# EasyEDA Pro project Charger Splitter.eprj, schematic Schematic1
Board Name: Board1; Create Date: 2025-09-04; Page Name: P1; Project Name: Charger Splitter; Schematic Name: Schematic1; Update Date: 2025-09-11; Company: EasyEDA.com; Page Size: A4; Version: V1.0
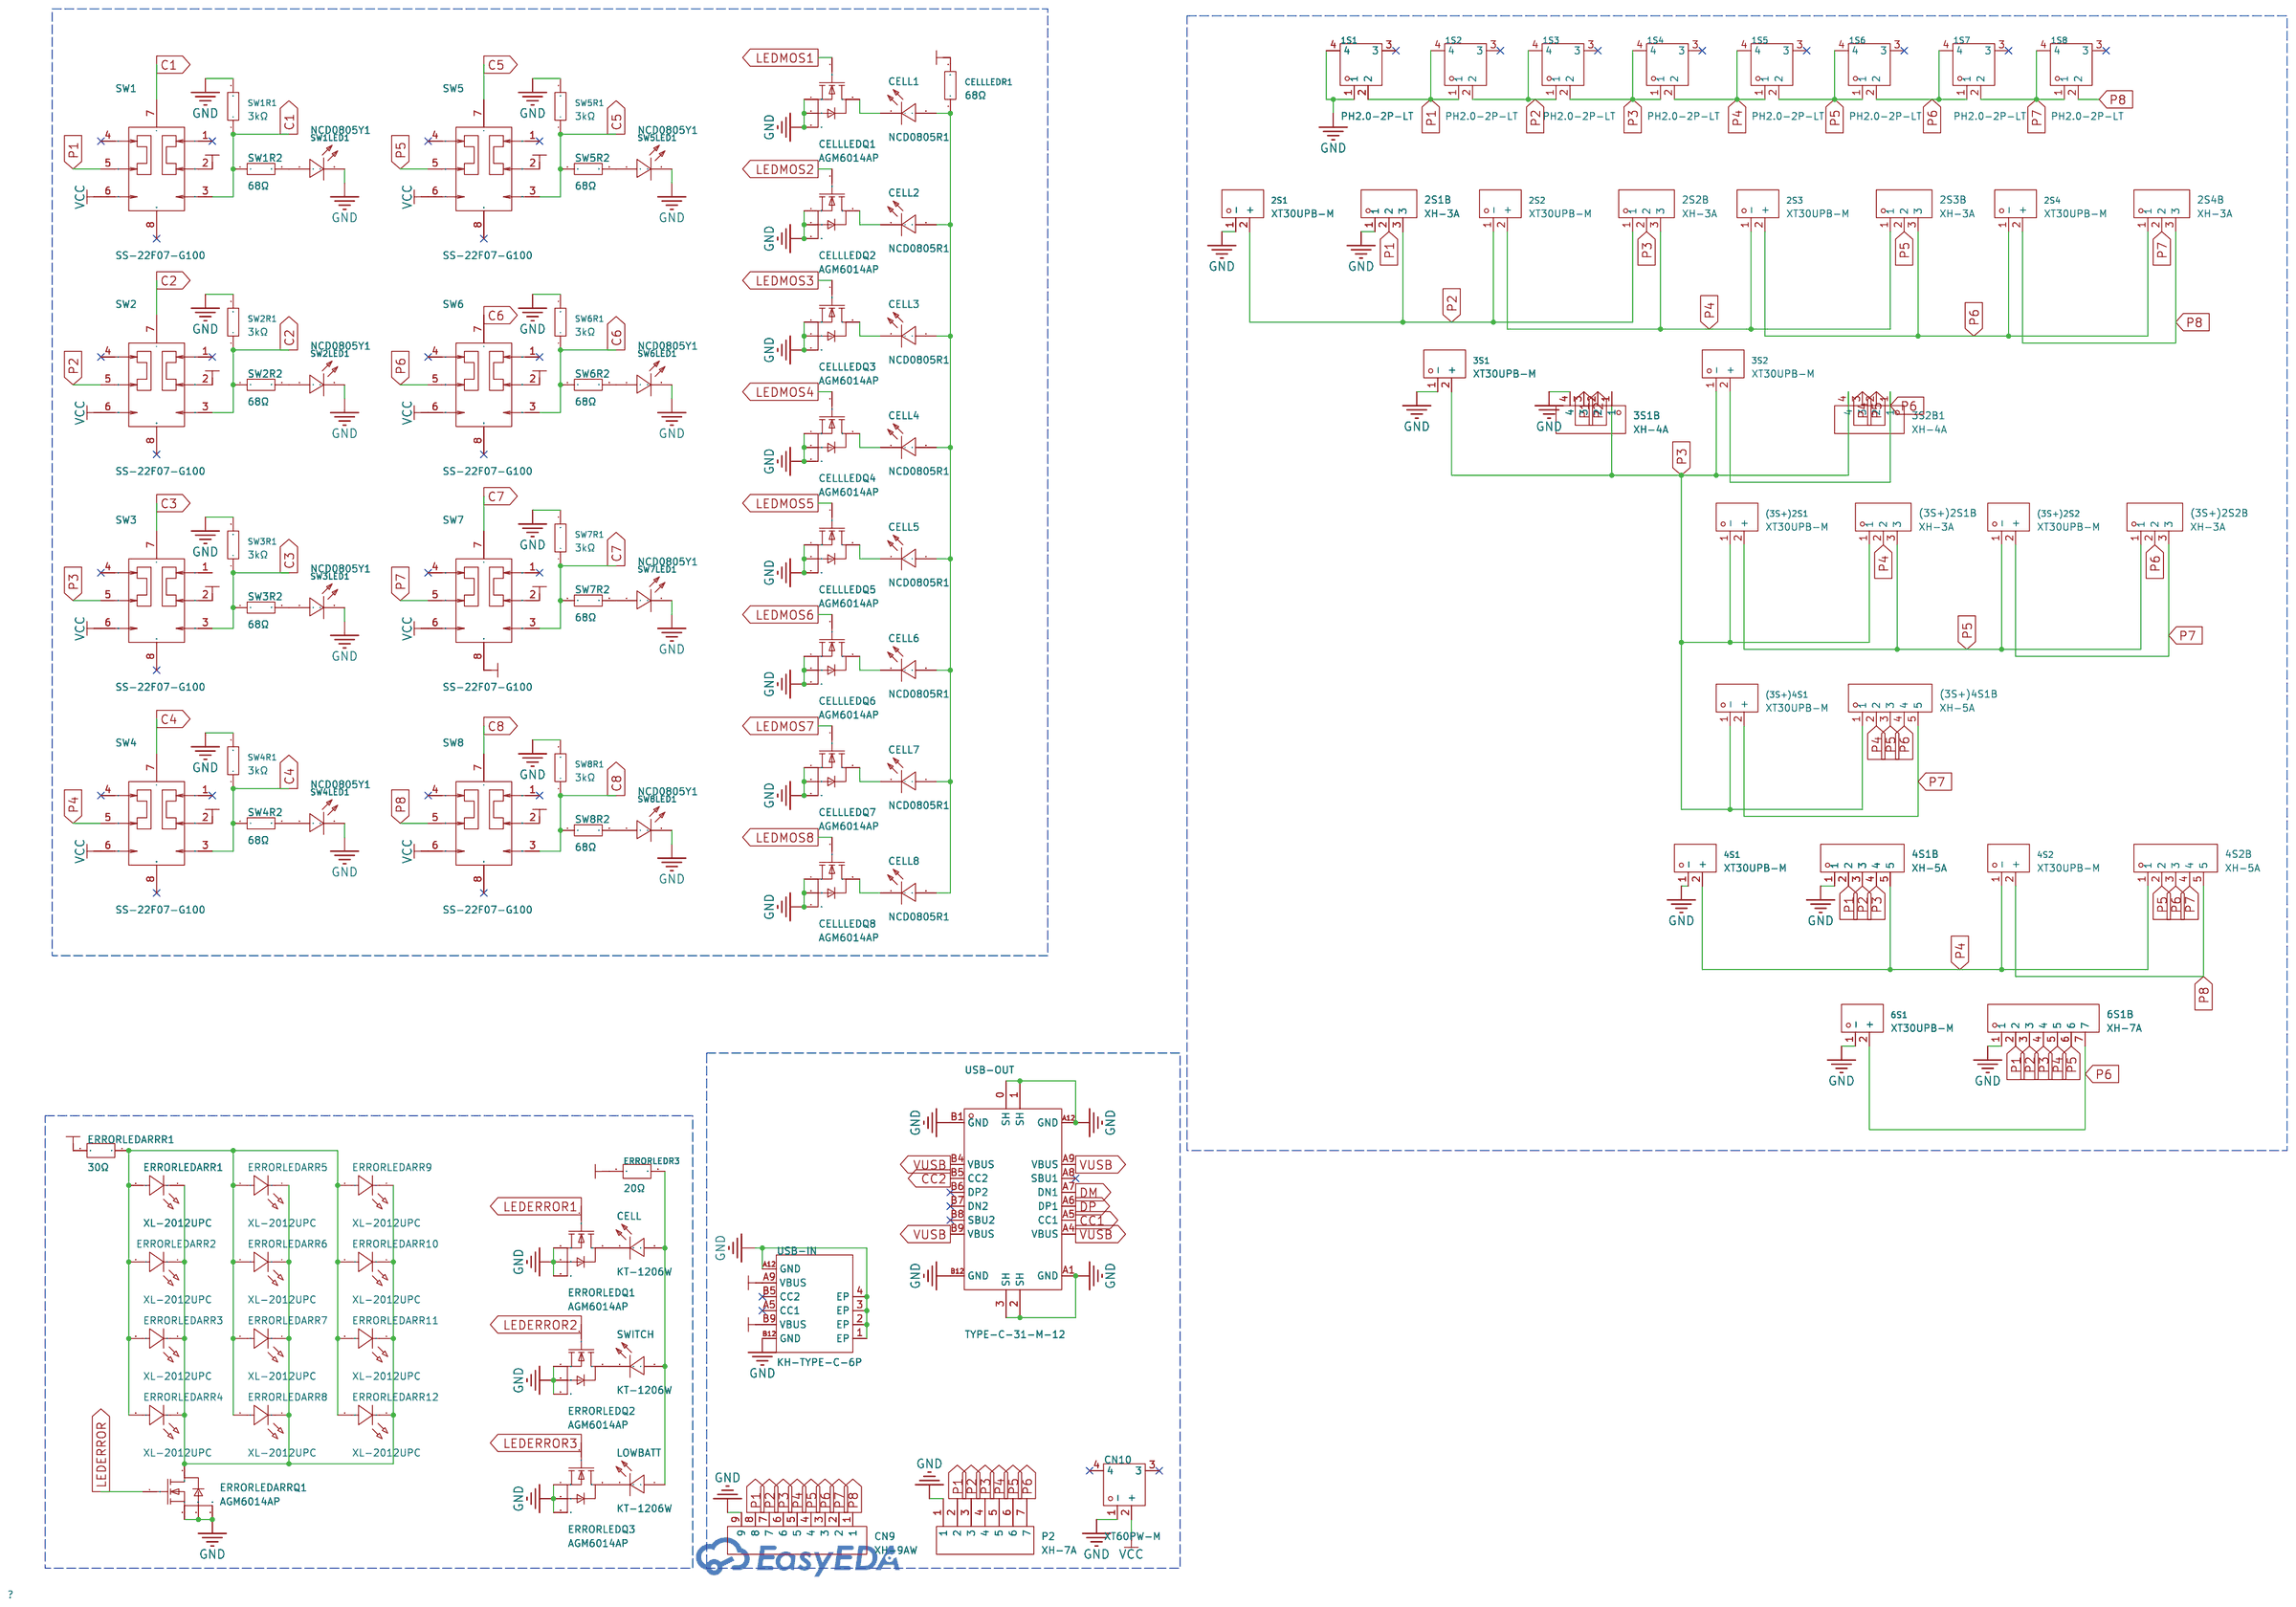
[diagram p0: schematic sheet]

## Parts
1S1  PH2.0-2P-LT  [CONN-SMD_PH2.0-1X2PW]
1S2  PH2.0-2P-LT  [CONN-SMD_PH2.0-1X2PW]
1S3  PH2.0-2P-LT  [CONN-SMD_PH2.0-1X2PW]
1S4  PH2.0-2P-LT  [CONN-SMD_PH2.0-1X2PW]
1S5  PH2.0-2P-LT  [CONN-SMD_PH2.0-1X2PW]
1S6  PH2.0-2P-LT  [CONN-SMD_PH2.0-1X2PW]
1S7  PH2.0-2P-LT  [CONN-SMD_PH2.0-1X2PW]
1S8  PH2.0-2P-LT  [CONN-SMD_PH2.0-1X2PW]
2S1  XT30UPB-M  [CONN-TH_XT30UPB-M]
2S1B  XH-3A  [CONN-TH_XH-3A]
2S2  XT30UPB-M  [CONN-TH_XT30UPB-M]
2S2B  XH-3A  [CONN-TH_XH-3A]
2S3  XT30UPB-M  [CONN-TH_XT30UPB-M]
2S3B  XH-3A  [CONN-TH_XH-3A]
2S4  XT30UPB-M  [CONN-TH_XT30UPB-M]
2S4B  XH-3A  [CONN-TH_XH-3A]
3S1  XT30UPB-M  [CONN-TH_XT30UPB-M]
3S1B  XH-4A  [CONN-TH_XH2.50-4P]
3S2  XT30UPB-M  [CONN-TH_XT30UPB-M]
3S2B1  XH-4A  [CONN-TH_XH2.50-4P]
4S1  XT30UPB-M  [CONN-TH_XT30UPB-M]
4S1B  XH-5A  [CONN-TH_5P-P2.50_XH-5A]
4S2  XT30UPB-M  [CONN-TH_XT30UPB-M]
4S2B  XH-5A  [CONN-TH_5P-P2.50_XH-5A]
6S1  XT30UPB-M  [CONN-TH_XT30UPB-M]
6S1B  XH-7A  [CONN-TH_7P-P2.50_HCTL_XH-7A]
(3S+)2S1  XT30UPB-M  [CONN-TH_XT30UPB-M]
(3S+)2S1B  XH-3A  [CONN-TH_XH-3A]
(3S+)2S2  XT30UPB-M  [CONN-TH_XT30UPB-M]
(3S+)2S2B  XH-3A  [CONN-TH_XH-3A]
(3S+)4S1  XT30UPB-M  [CONN-TH_XT30UPB-M]
(3S+)4S1B  XH-5A  [CONN-TH_5P-P2.50_XH-5A]
CELL  KT-1206W  [LED1206-R-RD_WHITE]
CELL1  NCD0805R1  [LED0805-R-RD]
CELL2  NCD0805R1  [LED0805-R-RD]
CELL3  NCD0805R1  [LED0805-R-RD]
CELL4  NCD0805R1  [LED0805-R-RD]
CELL5  NCD0805R1  [LED0805-R-RD]
CELL6  NCD0805R1  [LED0805-R-RD]
CELL7  NCD0805R1  [LED0805-R-RD]
CELL8  NCD0805R1  [LED0805-R-RD]
CELLLEDQ1  AGM6014AP  [PDFN-8_L3.1-W3.0-P0.65-LS3.3-BL]
CELLLEDQ2  AGM6014AP  [PDFN-8_L3.1-W3.0-P0.65-LS3.3-BL]
CELLLEDQ3  AGM6014AP  [PDFN-8_L3.1-W3.0-P0.65-LS3.3-BL]
CELLLEDQ4  AGM6014AP  [PDFN-8_L3.1-W3.0-P0.65-LS3.3-BL]
CELLLEDQ5  AGM6014AP  [PDFN-8_L3.1-W3.0-P0.65-LS3.3-BL]
CELLLEDQ6  AGM6014AP  [PDFN-8_L3.1-W3.0-P0.65-LS3.3-BL]
CELLLEDQ7  AGM6014AP  [PDFN-8_L3.1-W3.0-P0.65-LS3.3-BL]
CELLLEDQ8  AGM6014AP  [PDFN-8_L3.1-W3.0-P0.65-LS3.3-BL]
CELLLEDR1  68Ω  [R2512]
CN9  XH-9AW  [CONN-TH_9P-P2.50_XH-9AW]
CN10  XT60PW-M  [CONN-TH_XT60PW-M]
ERRORLEDARR1  XL-2012UPC  [LED0805-RD_PINK]
ERRORLEDARR2  XL-2012UPC  [LED0805-RD_PINK]
ERRORLEDARR3  XL-2012UPC  [LED0805-RD_PINK]
ERRORLEDARR4  XL-2012UPC  [LED0805-RD_PINK]
ERRORLEDARR5  XL-2012UPC  [LED0805-RD_PINK]
ERRORLEDARR6  XL-2012UPC  [LED0805-RD_PINK]
ERRORLEDARR7  XL-2012UPC  [LED0805-RD_PINK]
ERRORLEDARR8  XL-2012UPC  [LED0805-RD_PINK]
ERRORLEDARR9  XL-2012UPC  [LED0805-RD_PINK]
ERRORLEDARR10  XL-2012UPC  [LED0805-RD_PINK]
ERRORLEDARR11  XL-2012UPC  [LED0805-RD_PINK]
ERRORLEDARR12  XL-2012UPC  [LED0805-RD_PINK]
ERRORLEDARRQ1  AGM6014AP  [PDFN-8_L3.1-W3.0-P0.65-LS3.3-BL]
ERRORLEDARRR1  30Ω  [R2512]
ERRORLEDQ1  AGM6014AP  [PDFN-8_L3.1-W3.0-P0.65-LS3.3-BL]
ERRORLEDQ2  AGM6014AP  [PDFN-8_L3.1-W3.0-P0.65-LS3.3-BL]
ERRORLEDQ3  AGM6014AP  [PDFN-8_L3.1-W3.0-P0.65-LS3.3-BL]
ERRORLEDR3  20Ω  [R1210]
LOWBATT  KT-1206W  [LED1206-R-RD_WHITE]
P2  XH-7A  [CONN-TH_7P_XH-7A]
SW1  SS-22F07-G100  [SW-TH_6P-L16.5-W7.5-P4.0-LS2.6-TL]
SW1LED1  NCD0805Y1  [LED0805-R-RD]
SW1R1  3kΩ  [R0805]
SW1R2  68Ω  [R0805]
SW2  SS-22F07-G100  [SW-TH_6P-L16.5-W7.5-P4.0-LS2.6-TL]
SW2LED1  NCD0805Y1  [LED0805-R-RD]
SW2R1  3kΩ  [R0805]
SW2R2  68Ω  [R0805]
SW3  SS-22F07-G100  [SW-TH_6P-L16.5-W7.5-P4.0-LS2.6-TL]
SW3LED1  NCD0805Y1  [LED0805-R-RD]
SW3R1  3kΩ  [R0805]
SW3R2  68Ω  [R0805]
SW4  SS-22F07-G100  [SW-TH_6P-L16.5-W7.5-P4.0-LS2.6-TL]
SW4LED1  NCD0805Y1  [LED0805-R-RD]
SW4R1  3kΩ  [R0805]
SW4R2  68Ω  [R0805]
SW5  SS-22F07-G100  [SW-TH_6P-L16.5-W7.5-P4.0-LS2.6-TL]
SW5LED1  NCD0805Y1  [LED0805-R-RD]
SW5R1  3kΩ  [R0805]
SW5R2  68Ω  [R0805]
SW6  SS-22F07-G100  [SW-TH_6P-L16.5-W7.5-P4.0-LS2.6-TL]
SW6LED1  NCD0805Y1  [LED0805-R-RD]
SW6R1  3kΩ  [R0805]
SW6R2  68Ω  [R0805]
SW7  SS-22F07-G100  [SW-TH_6P-L16.5-W7.5-P4.0-LS2.6-TL]
SW7LED1  NCD0805Y1  [LED0805-R-RD]
SW7R1  3kΩ  [R0805]
SW7R2  68Ω  [R0805]
SW8  SS-22F07-G100  [SW-TH_6P-L16.5-W7.5-P4.0-LS2.6-TL]
SW8LED1  NCD0805Y1  [LED0805-R-RD]
SW8R1  3kΩ  [R0805]
SW8R2  68Ω  [R0805]
SWITCH  KT-1206W  [LED1206-R-RD_WHITE]
USB-IN  KH-TYPE-C-6P  [TYPE-C-SMD_TYPE-C-31-M-16]
USB-OUT  TYPE-C-31-M-12  [USB-C_SMD-TYPE-C-31-M-12]

## Library data of the parts
1S1-1S8 = PH2.0-2P-LT: Pins Structure:1x2P Pitch:2mm Mounting Style:Brick nogging Reference Series:- Number of Pins:2P Number of Rows:1 Number of PINs Per Row:2 Row Spacing:- Current Rating (Max):- Operating Temperature Range:- Operating Temperature Range:-; LCSC Part Name: 1x2P 间距:2mm 立贴; Supplier Part: C722761; Manufacturer: CAX(创都); Supplier Footprint: SMD,P=2mm; JLCPCB Part Class: Extended Part; Datasheet: https://atta.szlcsc.com/upload/public/pdf/source/20200902/C722761_7168BFE7362B0BB40E90E69EE754B0D4.pdf; Supplier: LCSC; Pins Structure: 1x2P; Pitch: 2mm; Mounting Style: Brick nogging; Number of Pins: 2P; Number of Rows: 1; Number of PINs Per Row: 2
2S1-2S4 3S1 3S2 4S1 4S2 6S1 (3S+)2S1 (3S+)2S2 (3S+)4S1 = XT30UPB-M: Power:- Output:- Input:- Size:- Interface:- Type:- Colour:Yellow MaximumCurrent:- Type:Aviation model plug RatedVoltage:DC 500V Type1:- NumberOfUSBHoles:- InterfaceType:Male MetalMaterial:Gold plating InsulationMaterial:PA RatedCurrent:15A RecommendedWire; LCSC Part Name: AMASS(艾迈斯)板载立式 航模锂电池控制器连接器插头 公头XT30UPB-M; Supplier Part: C428721; Manufacturer: AMASS(艾迈斯); JLCPCB Part Class: Extended Part; Datasheet: https://item.szlcsc.com/datasheet/XT30UPB-M/423831.html; Supplier: LCSC; Type: Aviation model plug; Colour: Yellow; RatedVoltage: DC 500V; InterfaceType: Male; MetalMaterial: Gold plating; InsulationMaterial: PA; RatedCurrent: 15A; contact resistance: 0.65mΩ
2S1B 2S2B 2S3B 2S4B (3S+)2S1B (3S+)2S2B = XH-3A: Pins Structure:1x3P Pitch:2.5mm Mounting Style:Straight Reference Series:XH Number of Pins:3P Number of Rows:1 Number of PINs Per Row:3 Row Spacing:- Current Rating (Max):3A Contact Material:Brass Contact Plating:Tin Operating Temperature Range:-25℃~+85℃; LCSC Part Name: 1x3P 间距:2.5mm 直插 系列:XH; Supplier Part: C2908601; Manufacturer: HCTL(华灿天禄); Supplier Footprint: 插件,P=2.5mm; JLCPCB Part Class: Extended Part; Datasheet: https://atta.szlcsc.com/upload/public/pdf/source/20230711/68D365716984B4AFE576D1D73D61B465.pdf; Supplier: LCSC; Pins Structure: 1x3P; Pitch: 2.5mm; Mounting Style: Straight; Reference Series: XH; Number of Pins: 3P; Number of Rows: 1; Number of PINs Per Row: 3; Current Rating (Max): 3A; Contact Material: Brass; Contact Plating: Tin; Operating Temperature Range: -25℃~+85℃
3S1B 3S2B1 = XH-4A_C2908602: Pins Structure:1x4P Pitch:2.5mm Mounting Style:Straight Reference Series:XH Number of Pins:4P Number of Rows:1 Number of PINs Per Row:4 Row Spacing:- Current Rating (Max):3A Contact Material:Brass Contact Plating:Tin Operating Temperature Range:-25℃~+85℃; LCSC Part Name: 1x4P 间距:2.5mm 直插 系列:XH; Supplier Part: C2908602; Manufacturer: HCTL(华灿天禄); Supplier Footprint: 插件,P=2.5mm; JLCPCB Part Class: Extended Part; Datasheet: https://atta.szlcsc.com/upload/public/pdf/source/20230711/68D365716984B4AFE576D1D73D61B465.pdf; Supplier: LCSC; Pins Structure: 1x4P; Pitch: 2.5mm; Mounting Style: Straight; Reference Series: XH; Number of Pins: 4P; Number of Rows: 1; Number of PINs Per Row: 4; Current Rating (Max): 3A; Contact Material: Brass; Contact Plating: Tin; Operating Temperature Range: -25℃~+85℃
4S1B 4S2B (3S+)4S1B = XH-5A_C2908603: Pins Structure:1x5P Pitch:2.5mm Mounting Style:Straight Reference Series:XH Number of Pins:5P Number of Rows:1 Number of PINs Per Row:5 Row Spacing:- Current Rating (Max):3A Contact Material:Brass Contact Plating:Tin Operating Temperature Range:-25℃~+85℃; LCSC Part Name: 1x5P 间距:2.5mm 直插 系列:XH; Supplier Part: C2908603; Manufacturer: HCTL(华灿天禄); Supplier Footprint: 插件,P=2.5mm; JLCPCB Part Class: Extended Part; Datasheet: https://atta.szlcsc.com/upload/public/pdf/source/20230711/68D365716984B4AFE576D1D73D61B465.pdf; Supplier: LCSC; Pins Structure: 1x5P; Pitch: 2.5mm; Mounting Style: Straight; Reference Series: XH; Number of Pins: 5P; Number of Rows: 1; Number of PINs Per Row: 5; Current Rating (Max): 3A; Contact Material: Brass; Contact Plating: Tin; Operating Temperature Range: -25℃~+85℃
6S1B = XH-7A: Pins Structure:1x7P Pitch:2.5mm Mounting Style:Straight Reference Series:XH Number of Pins:7P Number of Rows:1 Number of PINs Per Row:7 Row Spacing:- Current Rating (Max):3A Contact Material:Brass Contact Plating:Tin Operating Temperature Range:-25℃~+85℃; LCSC Part Name: 1x7P 间距:2.5mm 直插 系列:XH; Supplier Part: C2908605; Manufacturer: HCTL(华灿天禄); Supplier Footprint: 插件,P=2.5mm; JLCPCB Part Class: Extended Part; Datasheet: https://atta.szlcsc.com/upload/public/pdf/source/20230711/68D365716984B4AFE576D1D73D61B465.pdf; Supplier: LCSC; Pins Structure: 1x7P; Pitch: 2.5mm; Mounting Style: Straight; Reference Series: XH; Number of Pins: 7P; Number of Rows: 1; Number of PINs Per Row: 7; Current Rating (Max): 3A; Contact Material: Brass; Contact Plating: Tin; Operating Temperature Range: -25℃~+85℃
CELL LOWBATT SWITCH = KT-1206W: Emitted Color:White; LCSC Part Name: 1206 白灯 高亮; Supplier Part: C71796; Manufacturer: KENTO; Supplier Footprint: 1206; JLCPCB Part Class: Extended Part; Datasheet: https://atta.szlcsc.com/upload/public/pdf/source/20170415/1492238471204.pdf; Supplier: LCSC; Emitted Color: White
CELL1-CELL8 = NCD0805R1_C84256: Lamp Holder Type:- Emitted Color:Red Forward Voltage (VF):1.6V~2.6V Forward Voltage (VF):1.6V~2.6V Power Dissipation:65mW Forward Current:20mA Dominant Wavelength:615nm~630nm Dominant Wavelength:615nm~630nm Peak Wavelength:- Diode Configuration:独立二极管 Lens; Supplier Part: C84256; Manufacturer: 国星光电; Supplier Footprint: 0805; JLCPCB Part Class: Basic Part; Datasheet: https://atta.szlcsc.com/upload/public/pdf/source/20200820/C84256_F0A75A43B3EAD75808600A0514C76B99.pdf; Supplier: LCSC; Emitted Color: Red; Forward Voltage (VF): 1.6V~2.6V; Power Dissipation: 65mW; Forward Current: 20mA; Dominant Wavelength: 615nm~630nm; Diode Configuration: 独立二极管; Lens Color: 无色透明透镜; Luminous Intensity: 67mcd~195mcd; Viewing Angle: 130°; Operating Temperature: -30℃~+85℃
CELLLEDQ1-CELLLEDQ8 ERRORLEDARRQ1 ERRORLEDQ1-ERRORLEDQ3 = AGM6014AP: Number:1 N-Channel Drain to Source Voltage:60V Current - Continuous Drain(Id):72A RDS(on):4.3mΩ@10V Pd - Power Dissipation:54W Gate Threshold Voltage (Vgs(th)):1.6V@250uA Gate Charge(Qg):33nC@10V Input Capacitance(Ciss):1.524nF Reverse Transfer Capacitanc; LCSC Part Name: 1个N沟道 耐压:60V 电流:72A; Supplier Part: C6719405; Manufacturer: AGM-Semi(芯控源); Supplier Footprint: PDFN-8(3.3x3.3); JLCPCB Part Class: Extended Part; Datasheet: https://item.szlcsc.com/datasheet/AGM6014AP/7677118.html; Supplier: LCSC; Number: 1 N-Channel; Drain to Source Voltage: 60V; Current - Continuous Drain(Id): 72A; RDS(on): 4.3mΩ@10V; Pd - Power Dissipation: 54W; Gate Threshold Voltage (Vgs(th)): 1.6V@250uA; Gate Charge(Qg): 33nC@10V; Input Capacitance(Ciss): 1.524nF; Reverse Transfer Capacitance (Crss@Vds): 31pF; Operating Temperature: -55℃~+150℃; Output Capacitance(Coss): 631pF
CELLLEDR1 = 25121WF680JT4E: Type:Thick Film Resistor Resistance:68Ω Tolerance:±1% Tolerance:±1% Power(Watts):1W Voltage-Supply(Max):200V Temperature Coefficient:±100ppm/℃ Temperature Coefficient:±100ppm/℃ Operating Temperature:-55℃~+155℃ Operating Temperature:-55℃~+155℃; LCSC Part Name: 68Ω ±1% 1W 厚膜电阻; Supplier Part: C50371; Manufacturer: UNI-ROYAL(厚声); Supplier Footprint: 2512; JLCPCB Part Class: Extended Part; Datasheet: https://item.szlcsc.com/datasheet/25121WF680JT4E/51380.html; Supplier: LCSC; Type: Thick Film Resistor; Tolerance: ±1%; Power(Watts): 1W; Voltage-Supply(Max): 200V; Temperature Coefficient: ±100ppm/℃; Operating Temperature: -55℃~+155℃
CN9 = XH-9AW_C44437: Pins Structure:1x9P Pitch:2.5mm Mounting Type:Bend-in Reference Series:XH Number of Pins:9P Number of Rows:1 Number of PINs Per Row:9 Row Spacing:- Current Rating:- Contact Material:- Contact Plating:- Operating Temperature:- Operating Temperature:- Volta; LCSC Part Name: 1x9P 间距:2.5mm 弯插 系列:XH; Supplier Part: C44437; Manufacturer: BOOMELE(博穆精密); Supplier Footprint: 弯插,P=2.5mm; JLCPCB Part Class: Extended Part; Datasheet: https://atta.szlcsc.com/upload/public/pdf/source/20181205/C146112_2CB31444E6250AC61E2A41A9A8391D5F.pdf; Supplier: LCSC; Pins Structure: 1x9P; Pitch: 2.5mm; Mounting Type: Bend-in; Reference Series: XH; Number of Pins: 9P; Number of Rows: 1; Number of PINs Per Row: 9
CN10 = XT60PW-M: Power:- Output:- Input:- Size:- Interface:- Type:- Colour:Yellow MaximumCurrent:- Type:Horizontal plug RatedVoltage:- Type1:- NumberOfUSBHoles:- InterfaceType:Male MetalMaterial:- InsulationMaterial:- RatedCurrent:- RecommendedWireGauge:- FlameRetardantGr; LCSC Part Name: AMASS(艾迈斯)航模插头xt60连接器150公母对接pw锂电池公头 板插卧式XT60PW-M; Supplier Part: C98732; Manufacturer: AMASS(艾迈斯); JLCPCB Part Class: Extended Part; Datasheet: https://item.szlcsc.com/datasheet/XT60PW-M/99942.html; Supplier: LCSC; Type: Horizontal plug; Colour: Yellow; InterfaceType: Male
ERRORLEDARR1-ERRORLEDARR12 = XL-2012UPC: Lamp Holder Type:- Emitted Color:Pink Forward Voltage (VF):3.3V Forward Voltage (VF):3.3V Power Dissipation:70mW Forward Current:20mA Dominant Wavelength:- Dominant Wavelength:- Peak Wavelength:- Diode Configuration:- Lens Color:- Color Temperature:- Colo; Supplier Part: C965821; Manufacturer: XINGLIGHT(成兴光); Supplier Footprint: 0805; JLCPCB Part Class: Extended Part; Datasheet: https://atta.szlcsc.com/upload/public/pdf/source/20240218/A96AF37DA93958101EC7A9E354C28E93.pdf; Supplier: LCSC; Emitted Color: Pink; Forward Voltage (VF): 3.3V; Power Dissipation: 70mW; Forward Current: 20mA; Luminous Intensity: 303mcd; Viewing Angle: 120°; Mounting Sytle: Positive post; Operating Temperature: -20℃~+85℃
ERRORLEDARRR1 = 25121WF300JT4E: Type:Thick Film Resistor Resistance:30Ω Tolerance:±1% Tolerance:±1% Power(Watts):1W Voltage-Supply(Max):200V Temperature Coefficient:±100ppm/℃ Temperature Coefficient:±100ppm/℃ Operating Temperature:-55℃~+155℃ Operating Temperature:-55℃~+155℃; LCSC Part Name: 30Ω ±1% 1W 厚膜电阻; Supplier Part: C620878; Manufacturer: UNI-ROYAL(厚声); Supplier Footprint: 2512; JLCPCB Part Class: Extended Part; Datasheet: https://item.szlcsc.com/datasheet/25121WF300JT4E/650749.html; Supplier: LCSC; Type: Thick Film Resistor; Tolerance: ±1%; Power(Watts): 1W; Voltage-Supply(Max): 200V; Temperature Coefficient: ±100ppm/℃; Operating Temperature: -55℃~+155℃
ERRORLEDR3 = 1210W2F200JT5E: Type:Thick Film Resistor Resistance:20Ω Tolerance:±1% Tolerance:±1% Power(Watts):500mW Voltage-Supply(Max):200V Temperature Coefficient:±100ppm/℃ Temperature Coefficient:±100ppm/℃ Operating Temperature:-55℃~+155℃ Operating Temperature:-55℃~+155℃; LCSC Part Name: 20Ω ±1% 500mW 厚膜电阻; Supplier Part: C620667; Manufacturer: UNI-ROYAL(厚声); Supplier Footprint: 1210; JLCPCB Part Class: Extended Part; Datasheet: https://item.szlcsc.com/datasheet/1210W2F200JT5E/650538.html; Supplier: LCSC; Type: Thick Film Resistor; Tolerance: ±1%; Power(Watts): 500mW; Voltage-Supply(Max): 200V; Temperature Coefficient: ±100ppm/℃; Operating Temperature: -55℃~+155℃
P2 = XH-7A_C10384: Pins Structure:1x7P Pitch:2.5mm Mounting Type:Direct Insert Reference Series:XH Number of Pins:7P Number of Rows:1 Number of PINs Per Row:7 Row Spacing:- Current Rating:- Contact Material:- Contact Plating:- Operating Temperature:- Operating Temperature:-; LCSC Part Name: 1x7P 间距:2.5mm 直插 系列:XH; Supplier Part: C10384; Manufacturer: BOOMELE(博穆精密); Supplier Footprint: 插件,P=2.5mm; JLCPCB Part Class: Extended Part; Datasheet: https://atta.szlcsc.com/upload/public/pdf/source/20151222/1457707654251.pdf; Supplier: LCSC; Pins Structure: 1x7P; Pitch: 2.5mm; Mounting Type: Direct Insert; Reference Series: XH; Number of Pins: 7P; Number of Rows: 1; Number of PINs Per Row: 7
SW1-SW8 = SS-22F07-G100: Actuator Color:Black Current Rating (DC):1A Voltage Rating (DC):24V Operating Temperature:-25℃~+70℃ Operating Temperature:-25℃~+70℃; LCSC Part Name: 拨动开关SS-22F07 柄高10mm; Supplier Part: C5446810; Manufacturer: G-Switch(品赞); Supplier Footprint: 插件; JLCPCB Part Class: Extended Part; Datasheet: https://atta.szlcsc.com/upload/public/pdf/source/20210728/C2848924_9F44589EA412D8E62CA97BAE44F5AD1F.pdf; Supplier: LCSC; Actuator Color: Black; Current Rating (DC): 1A; Voltage Rating (DC): 24V; Operating Temperature: -25℃~+70℃
SW1LED1 SW2LED1 SW3LED1 SW4LED1 SW5LED1 SW6LED1 SW7LED1 SW8LED1 = NCD0805Y1: Emitted Color:Yellow Forward Voltage (VF):1.6V~2.6V Forward Voltage (VF):1.6V~2.6V Power Dissipation:65mW Forward Current:20mA Dominant Wavelength:585nm~596nm Dominant Wavelength:585nm~596nm Lens Color:无色透明透镜 Luminous Intensity:85mcd~180mcd Luminous Inten; Supplier Part: C84261; Manufacturer: 国星光电; Supplier Footprint: 0805; JLCPCB Part Class: Extended Part; Datasheet: https://atta.szlcsc.com/upload/public/pdf/source/20200820/C84261_818F20E00B0DEBCAFE3D9691CF5E5FF5.pdf; Supplier: LCSC; Emitted Color: Yellow; Forward Voltage (VF): 1.6V~2.6V; Power Dissipation: 65mW; Forward Current: 20mA; Dominant Wavelength: 585nm~596nm; Lens Color: 无色透明透镜; Luminous Intensity: 85mcd~180mcd; Viewing Angle: 130°; Operating Temperature: -30℃~+85℃
SW1R1 SW2R1 SW3R1 SW4R1 SW5R1 SW6R1 SW7R1 SW8R1 = 0805W8F3001T5E: Type:Thick Film Resistor Resistance:3kΩ Tolerance:±1% Tolerance:±1% Power(Watts):125mW Voltage-Supply(Max):150V Temperature Coefficient:±100ppm/℃ Temperature Coefficient:±100ppm/℃ Operating Temperature:-55℃~+155℃ Operating Temperature:-55℃~+155℃; LCSC Part Name: 3kΩ ±1% 125mW 厚膜电阻; Supplier Part: C17661; Manufacturer: UNI-ROYAL(厚声); Supplier Footprint: 0805; JLCPCB Part Class: Basic Part; Datasheet: https://item.szlcsc.com/datasheet/0805W8F3001T5E/18349.html; Supplier: LCSC; Type: Thick Film Resistor; Tolerance: ±1%; Power(Watts): 125mW; Voltage-Supply(Max): 150V; Temperature Coefficient: ±100ppm/℃; Operating Temperature: -55℃~+155℃
SW1R2 SW2R2 SW3R2 SW4R2 SW5R2 SW6R2 SW7R2 SW8R2 = RC0805FR-0768RL: Type:Thick Film Resistor Resistance:68Ω Tolerance:±1% Tolerance:±1% Power(Watts):125mW Voltage-Supply(Max):150V Temperature Coefficient:±100ppm/℃ Temperature Coefficient:±100ppm/℃ Operating Temperature:-55℃~+155℃ Operating Temperature:-55℃~+155℃; LCSC Part Name: 厚膜电阻 68Ω ±1% 125mW; Supplier Part: C137498; Manufacturer: YAGEO(国巨); Supplier Footprint: 0805; JLCPCB Part Class: Extended Part; Datasheet: https://item.szlcsc.com/datasheet/RC0805FR-0768RL/148814.html; Supplier: LCSC; Type: Thick Film Resistor; Tolerance: ±1%; Power(Watts): 125mW; Voltage-Supply(Max): 150V; Temperature Coefficient: ±100ppm/℃; Operating Temperature: -55℃~+155℃
USB-IN = KH-TYPE-C-6P_C709355: Connector Type:Type-C Protocol Standard:- Gender:Female Mounting Type:Horizontal attachment Number of Contacts:6P Number of Ports:1 Current Rating-Power:5A Operating Temperature:-25℃~+85℃ Operating Temperature:-25℃~+85℃; LCSC Part Name: Type-C 母 卧贴; Supplier Part: C709355; Manufacturer: kinghelm(金航标); Supplier Footprint: SMD; JLCPCB Part Class: Extended Part; Datasheet: https://atta.szlcsc.com/upload/public/pdf/source/20250117/2540434738F6D484C036EB4C5EFDD029.pdf; Supplier: LCSC; Connector Type: Type-C; Gender: Female; Mounting Type: Horizontal attachment; Number of Contacts: 6P; Number of Ports: 1; Current Rating-Power: 5A; Operating Temperature: -25℃~+85℃
USB-OUT = TYPE-C-31-M-12: Connector Type:Type-C Standard:- Gender:Female Mounting Style:- Number of Contacts:16P Number of Ports:1 Current Rating - Power (Max):5A Operating Temperature Range:- Operating Temperature Range:-; LCSC Part Name: Type-C 母; Supplier Part: C165948; Manufacturer: 韩国韩荣; Supplier Footprint: SMD; JLCPCB Part Class: Extended Part; Datasheet: https://atta.szlcsc.com/upload/public/pdf/source/20220525/466408E853115E789EDB0DDC29077C05.pdf; Supplier: LCSC; Connector Type: Type-C; Gender: Female; Number of Contacts: 16P; Number of Ports: 1; Current Rating - Power (Max): 5A

## Nets
3V3: CELLLEDR1.2 ERRORLEDARRR1.1 ERRORLEDR3.1 SW1.2 SW2.2 SW3.2 SW4.2 SW5.2 SW6.2 SW7.2 SW7.8 SW8.2
GND: 1S1.1 1S1.4 2S1.1(-) 2S1B.1 3S1.1(-) 3S1B.4 4S1.1(-) 4S1B.1 6S1.1(-) 6S1B.1 CELLLEDQ1.1(S) CELLLEDQ1.2(S) CELLLEDQ1.3(S) CELLLEDQ2.1(S) CELLLEDQ2.2(S) CELLLEDQ2.3(S) CELLLEDQ3.1(S) CELLLEDQ3.2(S) CELLLEDQ3.3(S) CELLLEDQ4.1(S) CELLLEDQ4.2(S) CELLLEDQ4.3(S) CELLLEDQ5.1(S) CELLLEDQ5.2(S) CELLLEDQ5.3(S) CELLLEDQ6.1(S) CELLLEDQ6.2(S) CELLLEDQ6.3(S) CELLLEDQ7.1(S) CELLLEDQ7.2(S) CELLLEDQ7.3(S) CELLLEDQ8.1(S) CELLLEDQ8.2(S) CELLLEDQ8.3(S) CN9.9 CN10.1(-) ERRORLEDARRQ1.1(S) ERRORLEDARRQ1.2(S) ERRORLEDARRQ1.3(S) ERRORLEDQ1.1(S) ERRORLEDQ1.2(S) ERRORLEDQ1.3(S) ERRORLEDQ2.1(S) ERRORLEDQ2.2(S) ERRORLEDQ2.3(S) ERRORLEDQ3.1(S) ERRORLEDQ3.2(S) ERRORLEDQ3.3(S) P2.1 SW1LED1.2(K) SW1R1.2 SW2LED1.2(K) SW2R1.2 SW3LED1.2(K) SW3R1.2 SW4LED1.2(K) SW4R1.2 SW5LED1.2(K) SW5R1.2 SW6LED1.2(K) SW6R1.2 SW7LED1.2(K) SW7R1.2 SW8LED1.2(K) SW8R1.2 USB-IN.1(EP) USB-IN.2(EP) USB-IN.3(EP) USB-IN.4(EP) USB-IN.A12(GND) USB-IN.B12(GND) USB-OUT.0(SH) USB-OUT.1(SH) USB-OUT.2(SH) USB-OUT.3(SH) USB-OUT.A1(GND) USB-OUT.A12(GND) USB-OUT.B1(GND) USB-OUT.B12(GND)
VCC: CN10.2(+) SW1.6 SW2.6 SW3.6 SW4.6 SW5.6 SW6.6 SW7.6 SW8.6
C1: SW1.3 SW1.7 SW1R1.1 SW1R2.1
C2: SW2.3 SW2.7 SW2R1.1 SW2R2.1
C3: SW3.3 SW3.7 SW3R1.1 SW3R2.1
C4: SW4.3 SW4.7 SW4R1.1 SW4R2.1
C5: SW5.3 SW5.7 SW5R1.1 SW5R2.1
C6: SW6.3 SW6.7 SW6R1.1 SW6R2.1
C7: SW7.3 SW7.7 SW7R1.1 SW7R2.1
C8: SW8.3 SW8.7 SW8R1.1 SW8R2.1
CC1: USB-OUT.A5(CC1)
CC2: USB-OUT.B5(CC2)
DM: USB-OUT.A7(DN1)
DP: USB-OUT.A6(DP1)
LEDERROR: ERRORLEDARRQ1.4(G)
LEDERROR1: ERRORLEDQ1.4(G)
LEDERROR2: ERRORLEDQ2.4(G)
LEDERROR3: ERRORLEDQ3.4(G)
LEDMOS1: CELLLEDQ1.4(G)
LEDMOS2: CELLLEDQ2.4(G)
LEDMOS3: CELLLEDQ3.4(G)
LEDMOS4: CELLLEDQ4.4(G)
LEDMOS5: CELLLEDQ5.4(G)
LEDMOS6: CELLLEDQ6.4(G)
LEDMOS7: CELLLEDQ7.4(G)
LEDMOS8: CELLLEDQ8.4(G)
P1: 1S1.2 1S2.1 1S2.4 2S1B.2 3S1B.3 4S1B.2 6S1B.2 CN9.8 P2.2 SW1.5
P2: 1S2.2 1S3.1 1S3.4 2S1.2(+) 2S1B.3 2S2.1(-) 2S2B.1 3S1B.2 4S1B.3 6S1B.3 CN9.7 P2.3 SW2.5
P3: 1S3.2 1S4.1 1S4.4 2S2B.2 3S1.2(+) 3S1B.1 3S2.1(-) 3S2B1.4 4S1B.4 6S1B.4 (3S+)2S1.1(-) (3S+)2S1B.1 (3S+)4S1.1(-) (3S+)4S1B.1 CN9.6 P2.4 SW3.5
P4: 1S4.2 1S5.1 1S5.4 2S2.2(+) 2S2B.3 2S3.1(-) 2S3B.1 3S2B1.3 4S1.2(+) 4S1B.5 4S2.1(-) 4S2B.1 6S1B.5 (3S+)2S1B.2 (3S+)4S1B.2 CN9.5 P2.5 SW4.5
P5: 1S5.2 1S6.1 1S6.4 2S3B.2 3S2B1.2 4S2B.2 6S1B.6 (3S+)2S1.2(+) (3S+)2S1B.3 (3S+)2S2.1(-) (3S+)2S2B.1 (3S+)4S1B.3 CN9.4 P2.6 SW5.5
P6: 1S6.2 1S7.1 1S7.4 2S3.2(+) 2S3B.3 2S4.1(-) 2S4B.1 3S2.2(+) 3S2B1.1 4S2B.3 6S1.2(+) 6S1B.7 (3S+)2S2B.2 (3S+)4S1B.4 CN9.3 P2.7 SW6.5
P7: 1S7.2 1S8.1 1S8.4 2S4B.2 4S2B.4 (3S+)2S2.2(+) (3S+)2S2B.3 (3S+)4S1.2(+) (3S+)4S1B.5 CN9.2 SW7.5
P8: 1S8.2 2S4.2(+) 2S4B.3 4S2.2(+) 4S2B.5 CN9.1 SW8.5
USBIN: USB-IN.A9(VBUS) USB-IN.B9(VBUS)
VUSB: USB-OUT.A4(VBUS) USB-OUT.A9(VBUS) USB-OUT.B4(VBUS) USB-OUT.B9(VBUS)
$2N10164: CELL1.1(+) CELL2.1(+) CELL3.1(+) CELL4.1(+) CELL5.1(+) CELL6.1(+) CELL7.1(+) CELL8.1(+) CELLLEDR1.1
$2N14912: CELL.1(A) ERRORLEDR3.2 LOWBATT.1(A) SWITCH.1(A)
$2N14921: ERRORLEDARR1.2(A) ERRORLEDARR2.2(A) ERRORLEDARR3.2(A) ERRORLEDARR4.2(A) ERRORLEDARR5.2(A) ERRORLEDARR6.2(A) ERRORLEDARR7.2(A) ERRORLEDARR8.2(A) ERRORLEDARR9.2(A) ERRORLEDARR10.2(A) ERRORLEDARR11.2(A) ERRORLEDARR12.2(A) ERRORLEDARRR1.2
$2N50043: SW1LED1.1(A) SW1R2.2
$2N54068: SW2LED1.1(A) SW2R2.2
$2N54232: SW3LED1.1(A) SW3R2.2
$2N54394: SW4LED1.1(A) SW4R2.2
$2N58407: SW5LED1.1(A) SW5R2.2
$2N62417: SW6LED1.1(A) SW6R2.2
$2N62582: SW7LED1.1(A) SW7R2.2
$2N62745: SW8LED1.1(A) SW8R2.2
Net-(CELL1-2): CELL1.2(-) CELLLEDQ1.5(D)
Net-(CELL2-2): CELL2.2(-) CELLLEDQ2.5(D)
Net-(CELL3-2): CELL3.2(-) CELLLEDQ3.5(D)
Net-(CELL4-2): CELL4.2(-) CELLLEDQ4.5(D)
Net-(CELL5-2): CELL5.2(-) CELLLEDQ5.5(D)
Net-(CELL6-2): CELL6.2(-) CELLLEDQ6.5(D)
Net-(CELL7-2): CELL7.2(-) CELLLEDQ7.5(D)
Net-(CELL8-2): CELL8.2(-) CELLLEDQ8.5(D)
Net-(CELL-2): CELL.2(K) ERRORLEDQ1.5(D)
Net-(ERRORLEDARR1-1): ERRORLEDARR1.1(K) ERRORLEDARR2.1(K) ERRORLEDARR3.1(K) ERRORLEDARR4.1(K) ERRORLEDARR5.1(K) ERRORLEDARR6.1(K) ERRORLEDARR7.1(K) ERRORLEDARR8.1(K) ERRORLEDARR9.1(K) ERRORLEDARR10.1(K) ERRORLEDARR11.1(K) ERRORLEDARR12.1(K) ERRORLEDARRQ1.5(D)
Net-(ERRORLEDQ2-5): ERRORLEDQ2.5(D) SWITCH.2(K)
Net-(ERRORLEDQ3-5): ERRORLEDQ3.5(D) LOWBATT.2(K)

Not connected (* = marked no-connect by the designer): 1S1 3*; 1S2 3*; 1S3 3*; 1S4 3*; 1S5 3*; 1S6 3*; 1S7 3*; 1S8 3*; CN10 3* 4*; SW1 1* 4* 8*; SW2 1* 4* 8*; SW3 1 4* 8*; SW4 1* 4* 8*; SW5 1* 4* 8*; SW6 1* 4* 8*; SW7 1* 4*; SW8 1* 4* 8*; USB-IN A5(CC1)* B5(CC2)*; USB-OUT A8(SBU1)* B6(DP2)* B7(DN2)* B8(SBU2)*
